# EasyEDA Pro project ProPrj_IR-Sensor-I2C_2025-01-15 (1).epro

# Schematic IR_ring_1
Board Name: IR-Sensoren_1; Create Date: 2025-01-15; Page Name: P2; Project Name: IR-Sensor-I2C; Schematic Name: IR_ring_1; Update Date: 2025-01-15; Company: Gymnasium der Stadt Rahden; Drawn: Louis Bertelsmann; Page Size: A5; Part Number: JLCPCB-001; Version: V0.1
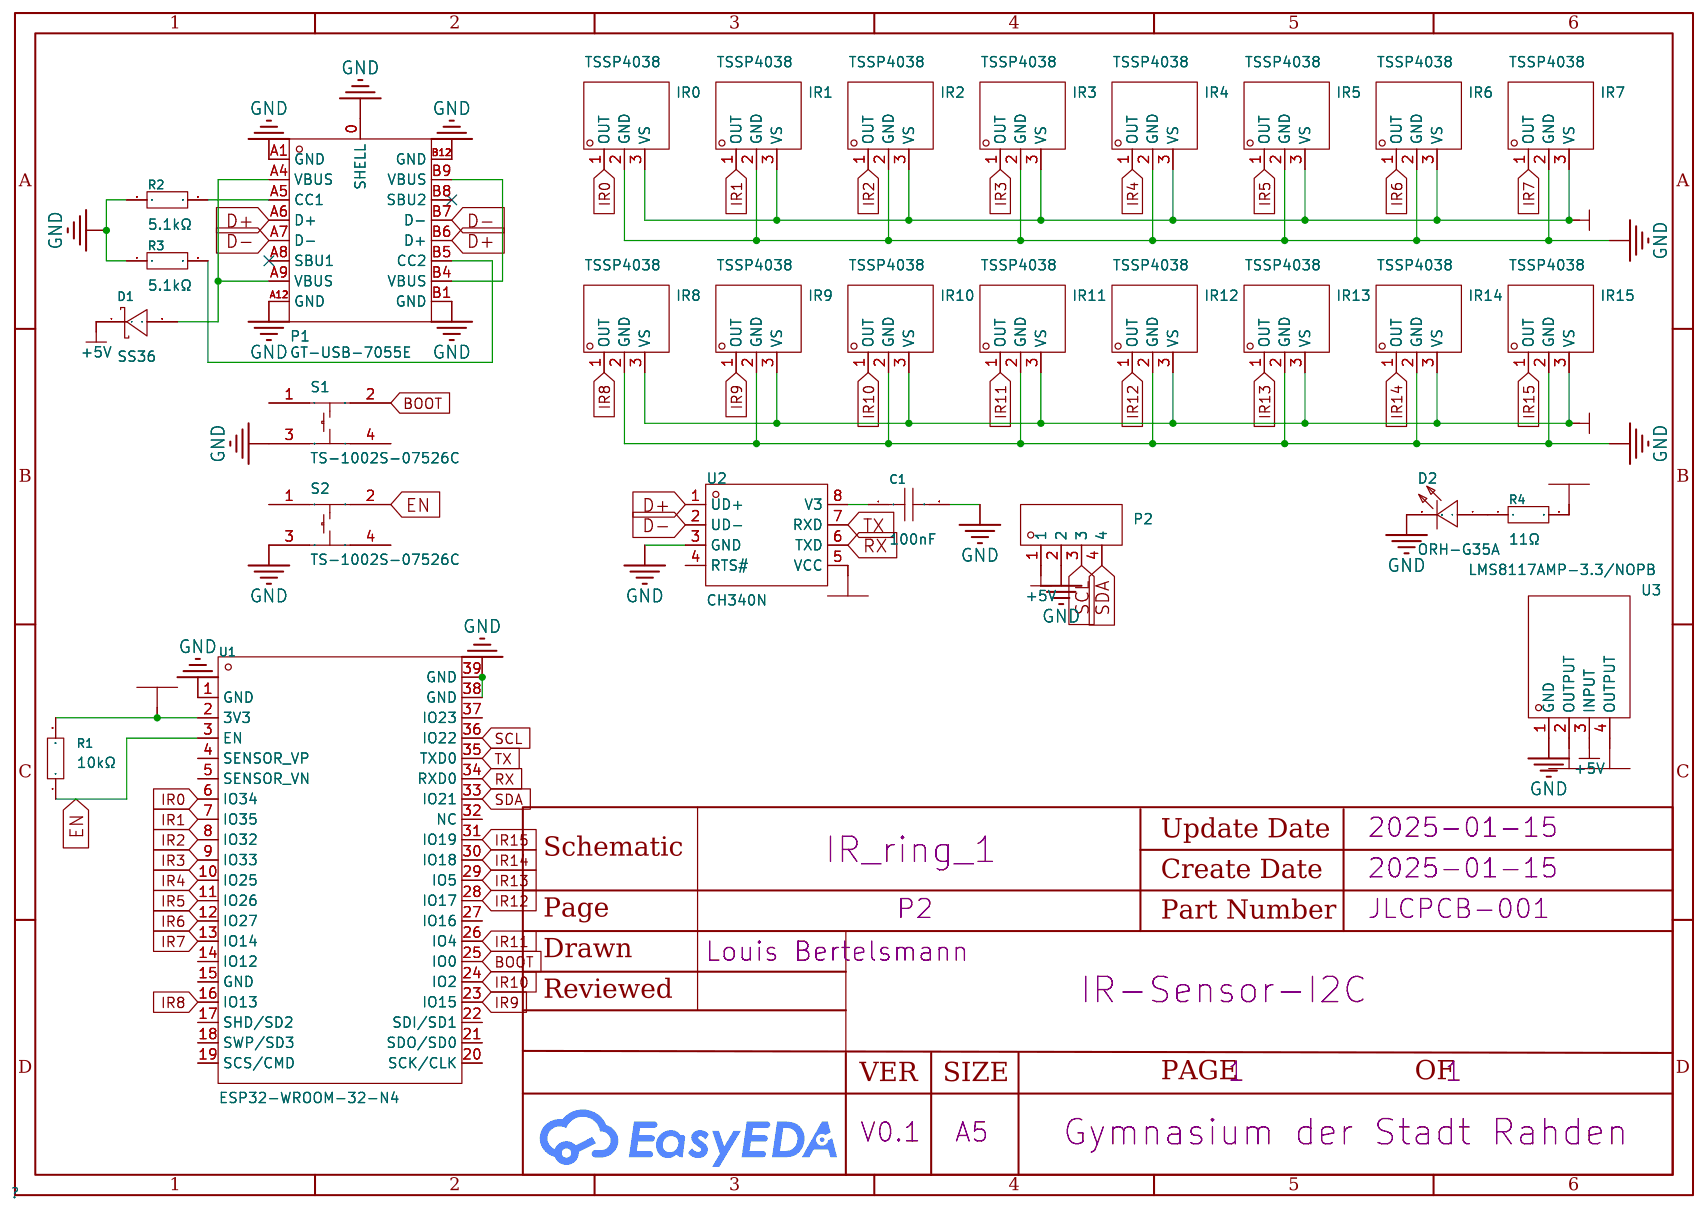
[diagram p0: schematic sheet]

## Parts
C1  100nF  [C0603]
D1  SS36  [SMA_L4.4-W2.8-LS5.4-RD]
D2  ORH-G35A  [LED0805-R-RD]
IR0  TSSP4038  [SENSOR-TH_TSSP40X]
IR1  TSSP4038  [SENSOR-TH_TSSP40X]
IR2  TSSP4038  [SENSOR-TH_TSSP40X]
IR3  TSSP4038  [SENSOR-TH_TSSP40X]
IR4  TSSP4038  [SENSOR-TH_TSSP40X]
IR5  TSSP4038  [SENSOR-TH_TSSP40X]
IR6  TSSP4038  [SENSOR-TH_TSSP40X]
IR7  TSSP4038  [SENSOR-TH_TSSP40X]
IR8  TSSP4038  [SENSOR-TH_TSSP40X]
IR9  TSSP4038  [SENSOR-TH_TSSP40X]
IR10  TSSP4038  [SENSOR-TH_TSSP40X]
IR11  TSSP4038  [SENSOR-TH_TSSP40X]
IR12  TSSP4038  [SENSOR-TH_TSSP40X]
IR13  TSSP4038  [SENSOR-TH_TSSP40X]
IR14  TSSP4038  [SENSOR-TH_TSSP40X]
IR15  TSSP4038  [SENSOR-TH_TSSP40X]
P1  GT-USB-7055E  [USB-C-SMD_GT-USB-7055E]
P2  DZ254S-11-04-48  [HDR-SMD_4P-P2.54-V-M-LS4.8_R2]
R1  10kΩ  [R0603]
R2  5.1kΩ  [R0603]
R3  5.1kΩ  [R0603]
R4  11Ω  [R0603]
S1  TS-1002S-07526C  [SW-SMD_4P-L6.0-W6.0-P4.50-LS9.0-2]
S2  TS-1002S-07526C  [SW-SMD_4P-L6.0-W6.0-P4.50-LS9.0-2]
U1  ESP32-WROOM-32-N4  [WIFIM-SMD_ESP32-WROOM-32-N4]
U2  CH340N  [SOP-8_L4.9-W3.9-P1.27-LS6.0-BL]
U3  LMS8117AMP-3.3/NOPB  [SOT-223_L6.5-W3.5-P2.30-LS7.0-BR]

## Library data of the parts
C1 = CC0603KRX7R9BB104: Capacitance: Tolerance:±10% Tolerance:±10% Voltage Rated: Temperature Coefficient:; LCSC Part Name: 100nF ±10% 50V; Supplier Part: C14663; Manufacturer: YAGEO(国巨); Supplier Footprint: 0603; JLCPCB Part Class: Basic Part; Datasheet: https://atta.szlcsc.com/upload/public/pdf/source/20180910/C282072_33301C7F631E79921B82A8DAC6BCC5B3.pdf; Supplier: LCSC; Tolerance: ±10%; Check: true
D1 = SS36_C116712: Forward Voltage (Vf@If):700mV@3A Reverse Voltage (Vr):60V Average Rectified Current (Io):3A; LCSC Part Name: 电压:60V 电流:3A; Supplier Part: C116712; Manufacturer: 晶导微电子; Supplier Footprint: SMA(DO-214AC); JLCPCB Part Class: Extended Part; Datasheet: https://atta.szlcsc.com/upload/public/pdf/source/20170804/C123938_1501836222047866178.pdf; Supplier: LCSC; Forward Voltage (Vf@If): 700mV@3A; Reverse Voltage (Vr): 60V; Average Rectified Current (Io): 3A; Check: true
D2 = ORH-G35A: Emitted Color:Emerald Forward Voltage (VF):2.7V~3.2V Forward Voltage (VF):2.7V~3.2V Power Dissipation:100mW Forward Current:20mA Dominant Wavelength:522nm~531nm Dominant Wavelength:522nm~531nm Peak Wavelength:525nm Diode Configuration:- Lens Color:无色透明透镜; Supplier Part: C205442; Manufacturer: Orient(奥伦德); Supplier Footprint: 0805; JLCPCB Part Class: Extended Part; Datasheet: https://atta.szlcsc.com/upload/public/pdf/source/20200803/C205442_47D51207775D70672DDC7D9D1E93F2D8.pdf; Supplier: LCSC; Emitted Color: Emerald; Forward Voltage (VF): 2.7V~3.2V; Power Dissipation: 100mW; Forward Current: 20mA; Dominant Wavelength: 522nm~531nm; Peak Wavelength: 525nm; Lens Color: 无色透明透镜; Luminous Intensity: 800mcd~1100mcd; Viewing Angle: 130°; Operating Temperature: -40℃~+85℃; Check: true
IR0-IR15 = TSSP4038: Supply Voltage:2.5V~5.5V Supply Voltage:2.5V~5.5V Supply Current:700uA Transmission Distance:25m Center Frequency:38kHz Half Angle:±45° Power Consumption:10mW Operating Temperature:-25℃~+85℃ Operating Temperature:-25℃~+85℃; LCSC Part Name: 接收距离25m ±45°; Supplier Part: C143753; Manufacturer: VISHAY(威世); Supplier Footprint: SIP-3-2.54mm; JLCPCB Part Class: Extended Part; Datasheet: https://atta.szlcsc.com/upload/public/pdf/source/20171128/C143753_15118626836821147288.pdf; Supplier: LCSC; Supply Voltage: 2.5V~5.5V; Supply Current: 700uA; Transmission Distance: 25m; Center Frequency: 38kHz; Half Angle: ±45°; Power Consumption: 10mW; Operating Temperature: -25℃~+85℃; Check: true
P1 = GT-USB-7055E: Connector Type:Type-C Standard:USB 2.0 Gender:Female Number of Ports:1 Number of Contacts:16P Mounting Style:Brick nogging Current Rating - Power (Max):5A Contact Material:高导铜 Contact Plating:Gold Operating Temperature Range:-40℃~+85℃ Operating Temperatur; LCSC Part Name: Type-C 母 立贴; Supplier Part: C7450622; Manufacturer: G-Switch(品赞); Supplier Footprint: SMD; JLCPCB Part Class: Extended Part; Datasheet: https://atta.szlcsc.com/upload/public/pdf/source/20230712/4C2907DAF9E937754FBC45253E388D05.pdf; Supplier: LCSC; Connector Type: Type-C; Standard: USB 2.0; Gender: Female; Number of Ports: 1; Number of Contacts: 16P; Mounting Style: Brick nogging; Current Rating - Power (Max): 5A; Contact Material: 高导铜; Contact Plating: Gold; Operating Temperature Range: -40℃~+85℃; Check: true
P2 = DZ254S-11-04-48: Pin Structure:1x4P Pitch:2.54mm Circluar Pins/Square Pins:Square Pins Mounting Type:Brick nogging Number of Rows:Plugin Number of Pins:4P; LCSC Part Name: 间距:2.54mm 1x4P 立贴 方针; Supplier Part: C5160787; Manufacturer: DEALON(德艺隆); Supplier Footprint: SMD,P=2.54mm(交错脚); JLCPCB Part Class: Extended Part; Datasheet: https://atta.szlcsc.com/upload/public/pdf/source/20230921/FE4E6D7F32A2CD9B95B1709A1ADE25FC.pdf; Supplier: LCSC; Pin Structure: 1x4P; Pitch: 2.54mm; Circluar Pins/Square Pins: Square Pins; Mounting Type: Brick nogging; Number of Rows: Plugin; Number of Pins: 4P; Check: true
R1 = 0603WAF1002T5E: Type:Thick Film Resistors Resistance:10kΩ Tolerance:±1% Tolerance:±1% Power(Watts): Overload Voltage (Max): Temperature Coefficient:±100ppm/℃ Temperature Coefficient:±100ppm/℃ Operating Temperature Range:-55℃~+155℃ Operating Temperature Range:-55℃~+155℃; LCSC Part Name: 厚膜电阻 10kΩ ±1% 100mW; Supplier Part: C25804; Manufacturer: UNI-ROYAL(厚声); Supplier Footprint: 0603; JLCPCB Part Class: Basic Part; Datasheet: https://atta.szlcsc.com/upload/public/pdf/source/20200306/C422600_1E6D84923E4A46A82E41ADD87F860B5C.pdf; Supplier: LCSC; Type: Thick Film Resistors; Tolerance: ±1%; Temperature Coefficient: ±100ppm/℃; Operating Temperature Range: -55℃~+155℃; Check: true
R2 R3 = 0603WAF5101T5E: Type:Thick Film Resistors Resistance:5.1kΩ Tolerance:±1% Tolerance:±1% Power(Watts): Overload Voltage (Max): Temperature Coefficient:±100ppm/℃ Temperature Coefficient:±100ppm/℃ Operating Temperature Range:-55℃~+155℃ Operating Temperature Range:-55℃~+155℃; LCSC Part Name: 5.1kΩ ±1% 100mW 厚膜电阻; Supplier Part: C23186; Manufacturer: UNI-ROYAL(厚声); Supplier Footprint: 0603; JLCPCB Part Class: Basic Part; Datasheet: https://atta.szlcsc.com/upload/public/pdf/source/20200306/C422600_1E6D84923E4A46A82E41ADD87F860B5C.pdf; Supplier: LCSC; Type: Thick Film Resistors; Tolerance: ±1%; Temperature Coefficient: ±100ppm/℃; Operating Temperature Range: -55℃~+155℃; Check: true
R4 = 0603WAF110JT5E: Type:Thick Film Resistors Resistance:11Ω Tolerance:±1% Tolerance:±1% Power(Watts): Overload Voltage (Max): Temperature Coefficient:±200ppm/℃ Temperature Coefficient:±200ppm/℃ Operating Temperature Range:-55℃~+155℃ Operating Temperature Range:-55℃~+155℃; LCSC Part Name: 11Ω ±1% 100mW 厚膜电阻; Supplier Part: C25184; Manufacturer: UNI-ROYAL(厚声); Supplier Footprint: 0603; JLCPCB Part Class: Extended Part; Datasheet: https://atta.szlcsc.com/upload/public/pdf/source/20200306/C422600_1E6D84923E4A46A82E41ADD87F860B5C.pdf; Supplier: LCSC; Type: Thick Film Resistors; Tolerance: ±1%; Temperature Coefficient: ±200ppm/℃; Operating Temperature Range: -55℃~+155℃; Check: true
S1 S2 = TS-1002S-07526C: Contact Current:50mA Voltage Rating (DC):12V Circuit:SPST Mounting Style:Brick nogging Actuator Style:Round Button With Lamp:- Switch Length:6mm Switch Width:6mm Switch Height:7.5mm; LCSC Part Name: 贴片轻触开关 260GF; Supplier Part: C455115; Manufacturer: XUNPU(讯普); Supplier Footprint: SMD,6x6x7.5mm; JLCPCB Part Class: Extended Part; Datasheet: https://atta.szlcsc.com/upload/public/pdf/source/20191118/C455115_D4B6DCDA06BDE14AA353AA414B73FF9E.pdf; Supplier: LCSC; Contact Current: 50mA; Voltage Rating (DC): 12V; Circuit: SPST; Mounting Style: Brick nogging; Actuator Style: Round Button; Switch Length: 6mm; Switch Width: 6mm; Switch Height: 7.5mm; Check: true
U1 = ESP32-WROOM-32-N4: LCSC Part Name: WiFi+蓝牙4.2+双核CPU模块; Supplier Part: C82899; Manufacturer: ESPRESSIF(乐鑫); Supplier Footprint: SMD,18x25.5mm; JLCPCB Part Class: Extended Part; Datasheet: https://atta.szlcsc.com/upload/public/pdf/source/20210719/C82899_2D52724B6FAFABC419BCF308C5944296.pdf; Supplier: LCSC; Check: true
U2 = CH340N: LCSC Part Name: USB转串口芯片 CH340; Supplier Part: C2977777; Manufacturer: WCH(南京沁恒); Supplier Footprint: SOP-8; JLCPCB Part Class: Extended Part; Datasheet: https://atta.szlcsc.com/upload/public/pdf/source/20230530/6E401E9554E9F5311886CC8B3F89B62E.pdf; Supplier: LCSC; Check: true
U3 = LMS8117AMP-3.3/NOPB: Output Type:Fixed Maximum Input Voltage:15V Output Voltage:3.3V Output Voltage:3.3V Output Current:1A Power Supply Rejection Ratio (PSRR):75dB@(120Hz) Dropout Voltage:1.25V@(1A) standby current:5mA Feature:防静电保护；Thermal Protection(TSD)；Overcurrent Protect; LCSC Part Name: 具有 0°C 至 125°C 工作温度范围的 1A、15V 高精度线性稳压器; Supplier Part: C201952; Manufacturer: TI(德州仪器); Supplier Footprint: SOT-223; JLCPCB Part Class: Extended Part; Datasheet: https://www.ti.com/cn/lit/gpn/lms8117a; Supplier: LCSC; Output Type: Fixed; Maximum Input Voltage: 15V; Output Voltage: 3.3V; Output Current: 1A; Power Supply Rejection Ratio (PSRR): 75dB@(120Hz); Dropout Voltage: 1.25V@(1A); standby current: 5mA; Feature: 防静电保护；Thermal Protection(TSD)；Overcurrent Protection(OCP)；带使能; Operating Temperature: 0℃~+125℃; Output Polarity: Positive electrode; Number of Outputs: 1; Check: true

## Nets
3V3: IR0.3(VS) IR1.3(VS) IR2.3(VS) IR3.3(VS) IR4.3(VS) IR5.3(VS) IR6.3(VS) IR7.3(VS) IR8.3(VS) IR9.3(VS) IR10.3(VS) IR11.3(VS) IR12.3(VS) IR13.3(VS) IR14.3(VS) IR15.3(VS) R1.2 R4.2 U1.2(3V3) U2.5(VCC) U3.2(OUTPUT) U3.4(OUTPUT)
+5V: D1.1(K) P2.1 U3.3(INPUT)
GND: C1.2 D2.2(C) IR0.2(GND) IR1.2(GND) IR2.2(GND) IR3.2(GND) IR4.2(GND) IR5.2(GND) IR6.2(GND) IR7.2(GND) IR8.2(GND) IR9.2(GND) IR10.2(GND) IR11.2(GND) IR12.2(GND) IR13.2(GND) IR14.2(GND) IR15.2(GND) P1.0(SHELL) P1.A1(GND) P1.A12(GND) P1.B1(GND) P1.B12(GND) P2.2 R2.1 R3.1 S1.3 S2.3 U1.1(GND) U1.38(GND) U1.39(GND) U2.3(GND) U3.1(GND)
BOOT: S1.2 U1.25(IO0)
D+: P1.A6(D+) P1.B6(D+) U2.1(UD+)
D-: P1.A7(D-) P1.B7(D-) U2.2(UD-)
EN: R1.1 S2.2 U1.3(EN)
IR0: IR0.1(OUT) U1.6(IO34)
IR1: IR1.1(OUT) U1.7(IO35)
IR2: IR2.1(OUT) U1.8(IO32)
IR3: IR3.1(OUT) U1.9(IO33)
IR4: IR4.1(OUT) U1.10(IO25)
IR5: IR5.1(OUT) U1.11(IO26)
IR6: IR6.1(OUT) U1.12(IO27)
IR7: IR7.1(OUT) U1.13(IO14)
IR8: IR8.1(OUT) U1.16(IO13)
IR9: IR9.1(OUT) U1.23(IO15)
IR10: IR10.1(OUT) U1.24(IO2)
IR11: IR11.1(OUT) U1.26(IO4)
IR12: IR12.1(OUT) U1.28(IO17)
IR13: IR13.1(OUT) U1.29(IO5)
IR14: IR14.1(OUT) U1.30(IO18)
IR15: IR15.1(OUT) U1.31(IO19)
RX: U1.34(RXD0) U2.6(TXD)
SCL: P2.3 U1.36(IO22)
SDA: P2.4 U1.33(IO21)
TX: U1.35(TXD0) U2.7(RXD)
$2N12726: C1.1 U2.8(V3)
$2N18778: P1.B4(VBUS) P1.B9(VBUS)
$2N18900: P1.A5(CC1) R2.2
$2N18903: P1.B5(CC2) R3.2
$2N18915: D1.2(A) P1.A4(VBUS) P1.A9(VBUS)
$2N23008: D2.1(A) R4.1

Not connected (* = marked no-connect by the designer): P1 A8(SBU1)* B8(SBU2)*; S1 1 4; S2 1 4; U1 4(SENSOR_VP) 5(SENSOR_VN) 14(IO12) 15(GND) 17(SHD/SD2) 18(SWP/SD3) 19(SCS/CMD) 20(SCK/CLK) 21(SDO/SD0) 22(SDI/SD1) 27(IO16) 32(NC) 37(IO23); U2 4(RTS#)

# Board IR-Ring_1
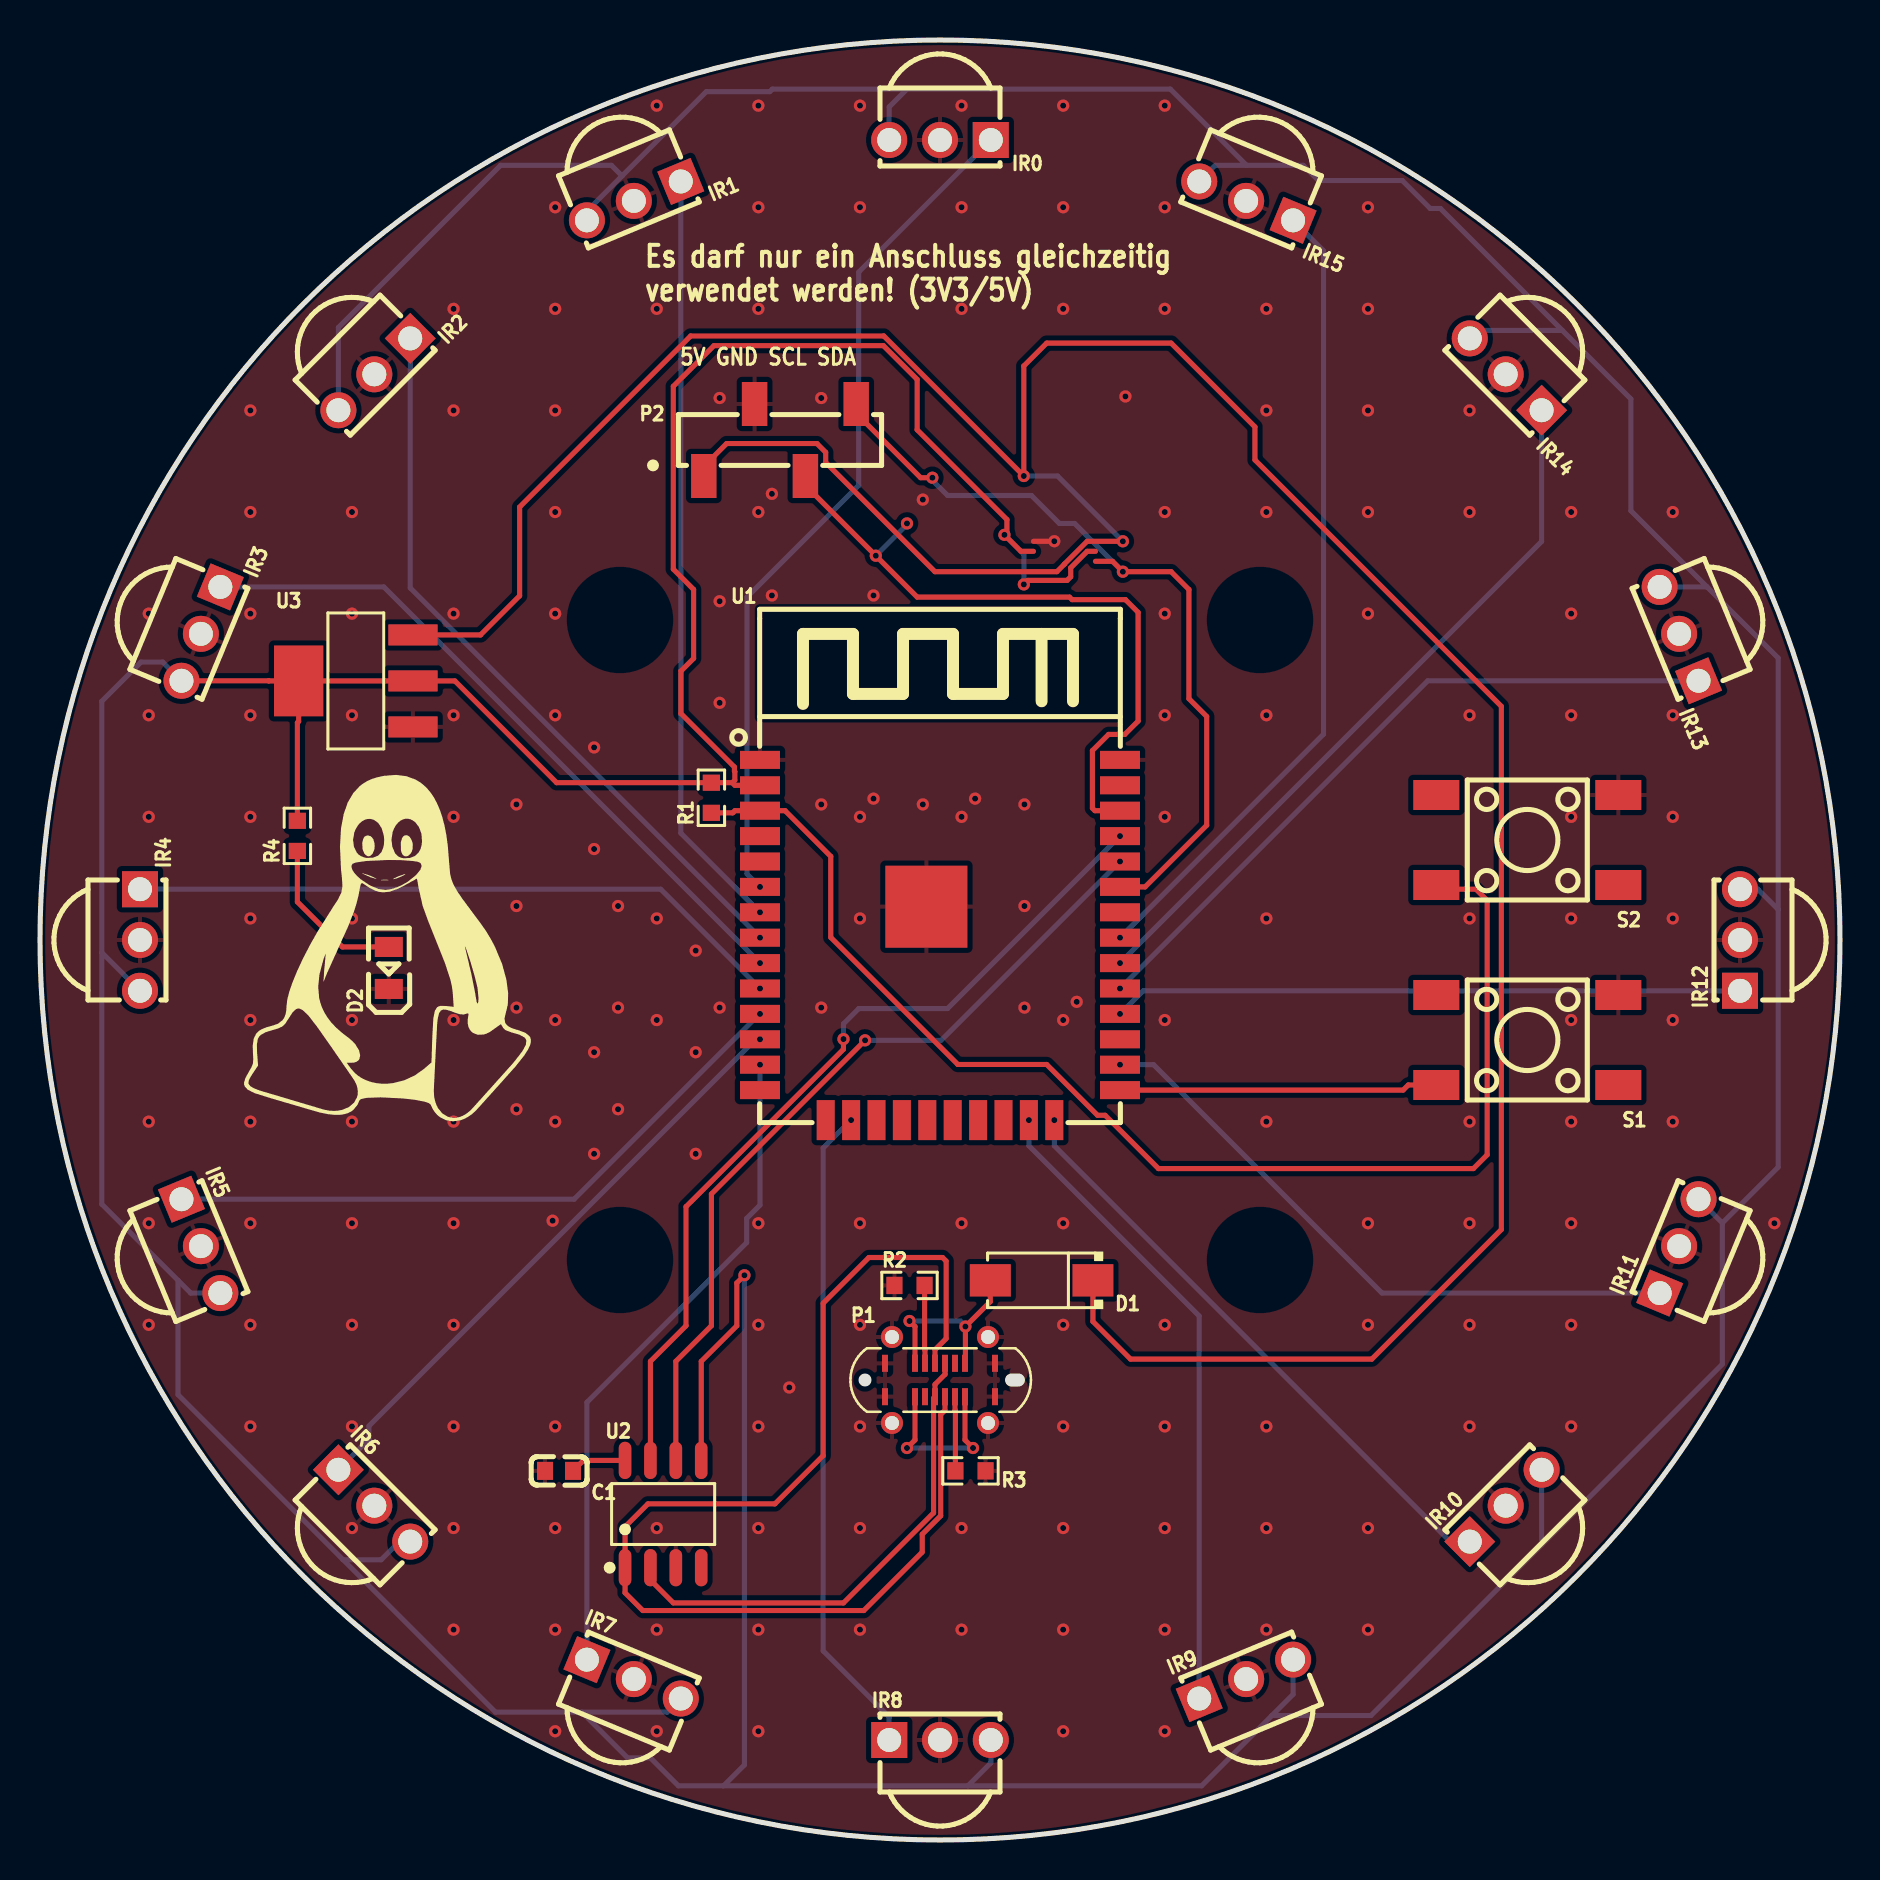
[diagram p1: board, top side]
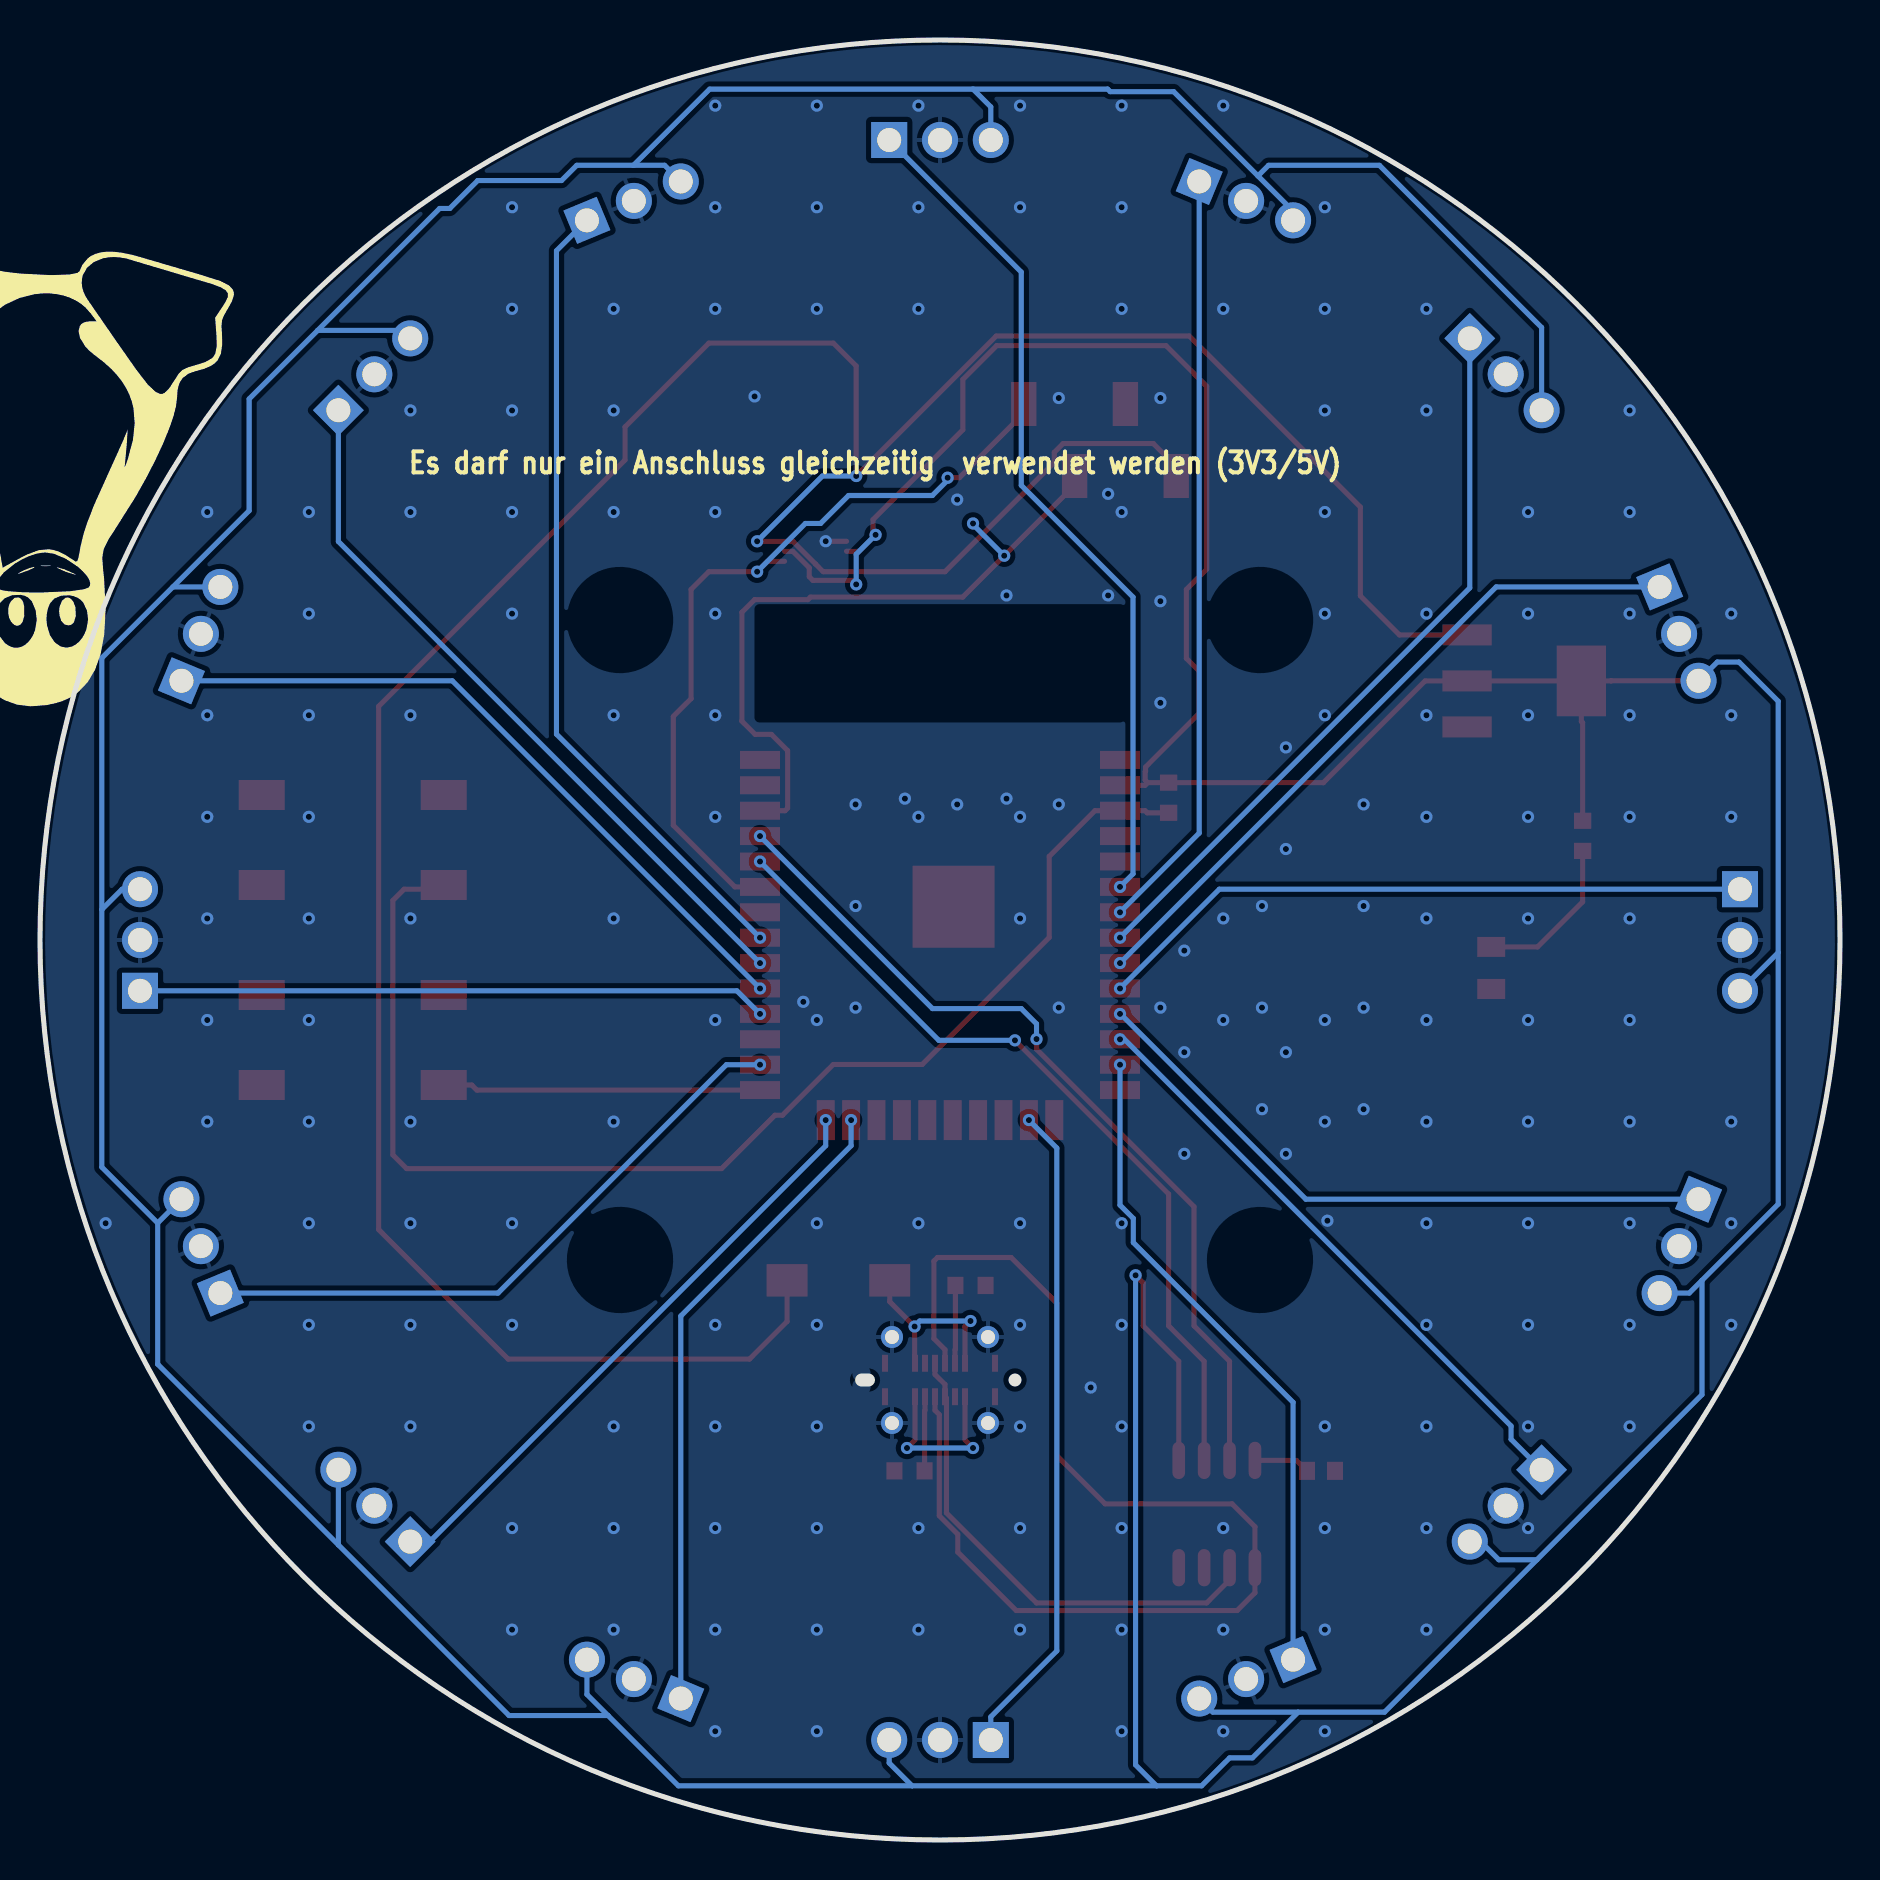
[diagram p2: board, bottom side, seen from below]

Outline 90 x 90 mm; copper layers: Top Layer, Bottom Layer. Coordinates in mm from the lower left corner of the outline.
Outline path: circle c45,45 r45
Stack: Top Layer 0.035mm / Dielectric1 1.51mm FR4 er 4.5 / Bottom Layer 0.035mm

## Design rules (mm)
template: JLCPCB Capability(Two Layers Board)
spacing copperThickness1oz (default): track to track 0.102, other pairs 0.152 to 0.3
spacing copperThickness2oz: track to track 0.203, other pairs 0.152 to 0.3
track width copperThickness1oz (default): min 0.127, default 0.254, max 2.54
track width copperThickness2oz: min 0.203, default 0.254, max 2.54
differential pair differentialPair (default): width min 0.127, default 0.254, max 2.54; gap min 0.152, default 0.152
via viaSize (default): diameter min 0.5, default 0.61, max 10; hole min 0.3, default 0.305, max 6.3

## Placement (name value [footprint] x y rotation side)
C1  100nF  [C0603]  25.95 18.46 180 top
D1  SS36  [SMA_L4.4-W2.8-LS5.4-RD]  50.08 27.98 180 top
D2  ORH-G35A  [LED0805-R-RD]  17.44 43.6 90 top
IR0  TSSP4038  [SENSOR-TH_TSSP40X]  45 85 180 top
IR1  TSSP4038  [SENSOR-TH_TSSP40X]  29.69 81.95 202.5 top
IR2  TSSP4038  [SENSOR-TH_TSSP40X]  16.72 73.28 225 top
IR3  TSSP4038  [SENSOR-TH_TSSP40X]  8.05 60.31 247.5 top
IR4  TSSP4038  [SENSOR-TH_TSSP40X]  5 45 270 top
IR5  TSSP4038  [SENSOR-TH_TSSP40X]  8.05 29.69 292.5 top
IR6  TSSP4038  [SENSOR-TH_TSSP40X]  16.72 16.72 315 top
IR7  TSSP4038  [SENSOR-TH_TSSP40X]  29.69 8.04 337.5 top
IR8  TSSP4038  [SENSOR-TH_TSSP40X]  45 5 0 top
IR9  TSSP4038  [SENSOR-TH_TSSP40X]  60.31 8.04 22.5 top
IR10  TSSP4038  [SENSOR-TH_TSSP40X]  73.28 16.72 45 top
IR11  TSSP4038  [SENSOR-TH_TSSP40X]  81.96 29.69 67.5 top
IR12  TSSP4038  [SENSOR-TH_TSSP40X]  85 45 90 top
IR13  TSSP4038  [SENSOR-TH_TSSP40X]  81.96 60.31 112.5 top
IR14  TSSP4038  [SENSOR-TH_TSSP40X]  73.28 73.28 135 top
IR15  TSSP4038  [SENSOR-TH_TSSP40X]  60.31 81.95 157.5 top
P1  GT-USB-7055E  [USB-C-SMD_GT-USB-7055E]  45 23 0 top
P2  DZ254S-11-04-48  [HDR-SMD_4P-P2.54-V-M-LS4.8_R2]  37 70 0 top
R1  10kΩ  [R0603]  33.57 52.11 90 top
R2  5.1kΩ  [R0603]  43.48 27.73 0 top
R3  5.1kΩ  [R0603]  46.52 18.46 180 top
R4  11Ω  [R0603]  12.87 50.21 90 top
S1  TS-1002S-07526C  [SW-SMD_4P-L6.0-W6.0-P4.50-LS9.0-2]  74.37 40 180 top
S2  TS-1002S-07526C  [SW-SMD_4P-L6.0-W6.0-P4.50-LS9.0-2]  74.37 50 180 top
U1  ESP32-WROOM-32-N4  [WIFIM-SMD_ESP32-WROOM-32-N4]  45 45 0 top
U2  CH340N  [SOP-8_L4.9-W3.9-P1.27-LS6.0-BL]  31.16 16.3 0 top
U3  LMS8117AMP-3.3/NOPB  [SOT-223_L6.5-W3.5-P2.30-LS7.0-BR]  15.79 57.95 0 top

## Footprints (pads in the part's own frame, mm; a bottom-side part is the same pattern mirrored in y, then rotated)
C0603
  rect 0.8x0.9 smd: 1(-0.7,0) 2(0.7,0)
HDR-SMD_4P-P2.54-V-M-LS4.8_R2
  rect 1.27x2.2 smd: 1(-3.81,-1.8) 2(-1.27,1.8) 3(1.27,-1.8) 4(3.81,1.8)
LED0805-R-RD
  rect 1x1.399 smd: 1(1.05,0) 2(-1.05,0)
R0603
  rect 0.806x0.864 smd: 1(-0.753,0) 2(0.753,0)
SENSOR-TH_TSSP40X
  rect 1.8x1.8 hole 1.2: 1(-2.54,0)
  round 1.8 hole 1.2: 2(0,0) 3(2.54,0)
SMA_L4.4-W2.8-LS5.4-RD
  rect 2.046x1.62 smd: 1(-2.566,0) 2(2.566,0)
SOP-8_L4.9-W3.9-P1.27-LS6.0-BL
  oval 0.63x1.865 smd: 1(-1.905,-2.683) 2(-0.635,-2.683) 3(0.635,-2.683) 4(1.905,-2.683) 5(1.905,2.683) 6(0.635,2.683) 7(-0.635,2.683) 8(-1.905,2.683)
SOT-223_L6.5-W3.5-P2.30-LS7.0-BR
  rect 2.465x1.05 smd: 1(2.857,-2.3) 2(2.857,0) 3(2.857,2.3)
  rect 2.465x3.54 smd: 4(-2.857,0)
SW-SMD_4P-L6.0-W6.0-P4.50-LS9.0-2
  rect 2.3x1.5 smd: 1(-4.55,2.25) 2(4.55,2.25) 3(-4.55,-2.25) 4(4.55,-2.25)
USB-C-SMD_GT-USB-7055E
  round 1.1 hole 0.7: 0(-2.4,2.15) 0(-2.4,-2.15) 0(2.4,2.15) 0(2.4,-2.15)
  rect 0.3x0.85 smd: A1(-2.75,0.835) A4(-1.25,0.835) A5(-0.75,0.835) A6(-0.25,0.835) A7(0.25,0.835) A8(0.75,0.835) A9(1.25,0.835) A12(2.75,0.835) B1(2.75,-0.835) B4(1.25,-0.835) B5(0.75,-0.835) B6(0.25,-0.835) B7(-0.25,-0.835) B8(-0.75,-0.835) B9(-1.25,-0.835) B12(-2.75,-0.835)
WIFIM-SMD_ESP32-WROOM-32-N4
  rect 2x0.9 smd: 1(-9,9.005) 2(-9,7.735) 3(-9,6.465) 4(-9,5.195) 5(-9,3.925) 6(-9,2.655) 7(-9,1.385) 8(-9,0.115) 9(-9,-1.155) 10(-9,-2.425) 11(-9,-3.695) 12(-9,-4.965) 13(-9,-6.235) 14(-9,-7.505) 25(9,-7.505) 26(9,-6.235) 27(9,-4.965) 28(9,-3.695) 29(9,-2.425) 30(9,-1.155) 31(9,0.115) 32(9,1.385) 33(9,2.655) 34(9,3.925) 35(9,5.195) 36(9,6.465) 37(9,7.735) 38(9,9.005)
  rect 0.9x2 smd: 15(-5.715,-9.005) 16(-4.445,-9.005) 17(-3.175,-9.005) 18(-1.905,-9.005) 19(-0.635,-9.005) 20(0.635,-9.005) 21(1.905,-9.005) 22(3.175,-9.005) 23(4.445,-9.005) 24(5.715,-9.005)
  rect 4.1x4.1 smd: 39(-0.68,1.665)

## Nets
As in the schematic.

Pads without a net: P1 A8 B8; S1 1 4; S2 1 4; U1 4 5 14 15 17 18 19 20 21 22 27 32 37; U2 4

## Via types
v1: diameter 0.61, hole 0.305, Top Layer to Bottom Layer, 221 vias

## Routing (per net, layer and track width the routed paths; a pad name or vN(x,y) marks a point on that pad's centre or on a via; arc(x,y) is an arc through that point)
3V3: length 440.6
  Top Layer w0.254: U3.4 12.93,55.93 12.87,55.87 R4.2 ; U3.4 11.45,57.95 11.44,57.96 IR3.3 ; U3.4 U3.2 20.74,57.95 25.83,52.87 R1.2 34.62,52.87 ; 34.62,52.87 34.74,52.99 34.74,53.42 34.72,53.44 34.72,53.65 32.05,56.32 32.05,58.44 32.68,59.08 32.68,62.53 31.66,63.54 31.66,72.69 33.7,74.72 42.17,74.72 43.86,73.03 43.86,70.51 48.35,66.02 48.35,65.39 v1(48.22,65.26) 49.04,64.44 49.67,64.44 ; 34.62,52.87 34.75,52.73 U1.2 ; U2.5 33.06,23.93 34.84,25.71 34.84,27.86 v1(35.22,28.24) ; 52.77,64.44 52.36,64.44 51.54,63.61 51.54,63.16 51.36,62.98 49.39,62.98 v1(49.19,62.78)
  Bottom Layer w0.254: 84.12,30.85 IR11.3 ; 84.12,30.85 84.12,23.79 75.08,14.76 ; 84.12,30.85 86.91,33.64 86.91,46.52 ; 76.12,75.48 79.54,72.05 79.54,66.46 83.35,62.65 ; 76.12,75.48 71.89,75.48 IR14.3 ; 76.12,75.48 70.02,81.58 69.51,81.58 68.11,82.97 63.92,82.97 63.16,83.73 60.33,83.73 ; 27.09,6.39 31.36,6.39 IR7.3 ; 27.09,6.39 22.78,6.39 15.16,14.01 ; 27.09,6.39 29.38,4.11 30.52,4.11 31.92,2.71 34.17,2.71 ; 46.4,2.71 47.54,3.85 IR8.3 ; 46.4,2.71 34.17,2.71 ; 46.4,2.71 58.08,2.71 61.59,6.22 ; 75.08,14.76 IR10.3 ; 75.08,14.76 66.55,6.22 61.59,6.22 ; 43.35,87.55 42.46,86.66 IR0.3 ; 43.35,87.55 36.62,87.55 36.49,87.42 33.32,87.42 29.1,83.2 ; 43.35,87.55 56.52,87.55 60.33,83.73 ; 3.09,44.37 3.09,31.79 6.9,27.98 ; 3.09,44.37 3.09,56.94 5.05,58.9 6.14,58.9 IR3.3 ; 3.09,44.37 IR4.3 ; 61.59,6.22 62.65,7.28 62.65,9.02 ; IR12.3 85.89,47.54 86.91,46.52 ; 60.33,83.73 58.77,83.73 IR15.3 ; 6.9,27.98 6.9,22.27 15.16,14.01 ; 6.9,27.98 7.54,27.35 9.02,27.35 ; 86.91,46.52 86.91,59.1 83.35,62.65 ; 27.35,80.98 27.35,81.45 29.1,83.2 ; 15.16,14.01 17.06,14.01 17.97,14.92 IR6.3 ; 83.35,62.65 80.98,62.65 ; v1(49.19,62.78) 49.19,64.29 v1(48.22,65.26) ; v1(35.22,28.24) 35.22,3.76 34.17,2.71 ; IR2.3 14.92,75.63 23.03,83.73 28.57,83.73 29.1,83.2
+5V: length 164.5
  Top Layer w0.254: U3.3 22.03,60.25 23.98,62.21 23.98,66.65 32.53,75.2 42.19,75.2 v1(49.19,68.2) 49.19,73.7 50.33,74.84 56.56,74.84 60.75,70.65 60.75,69 73.07,56.68 73.07,30.52 66.59,24.04 54.53,24.04 52.65,25.92 D1.1 ; P2.1 33.19,68.68 34.33,69.82 38.85,69.82 39.28,69.38 39.28,68.88 44.75,63.42 50.84,63.42 51.22,63.8 51.22,63.8 52.36,64.94 v1(54.14,64.94)
  Bottom Layer w0.254: v1(49.19,68.2) 50.88,68.2 v1(54.14,64.94)
GND: length 1
  Top Layer w0.254: v1(50.72,64.94) 50.71,64.94 49.67,64.94
  vias: v1(5.44,61.32) v1(5.44,56.24) v1(5.44,51.16) v1(5.44,35.92) v1(5.44,30.84) v1(5.44,25.76) v1(10.52,71.48) v1(10.52,66.4) v1(10.52,61.32) v1(10.52,56.24) v1(10.52,51.16) v1(10.52,46.08) v1(10.52,41) v1(10.52,35.92) v1(10.52,30.84) v1(10.52,25.76) v1(10.52,20.68) v1(15.6,66.4) v1(15.6,61.32) v1(15.6,56.24) v1(15.6,51.16) v1(15.6,46.08) v1(15.6,41) v1(15.6,35.92) v1(15.6,30.84) v1(15.6,25.76) v1(15.6,20.68) v1(15.6,15.6) v1(20.68,76.56) v1(20.68,71.48) v1(20.68,61.32) v1(20.68,56.24) v1(20.68,51.16) v1(20.68,46.08) v1(20.68,41) v1(20.68,35.92) v1(20.68,30.84) v1(20.68,25.76) v1(20.68,20.68) v1(20.68,15.6) v1(20.68,10.52) v1(23.82,51.78) v1(23.82,46.7) v1(23.82,41.62) v1(23.82,36.54) v1(25.63,30.97) v1(25.76,81.64) v1(25.76,76.56) v1(25.76,71.48) v1(25.76,66.4) v1(25.76,61.32) v1(25.76,56.24) v1(25.76,41) v1(25.76,35.92) v1(25.76,20.68) v1(25.76,15.6) v1(25.76,10.52) v1(25.76,5.44) v1(27.71,54.63) v1(27.71,49.55) v1(27.71,39.39) v1(27.71,34.31) v1(28.9,46.7) v1(28.9,41.62) v1(28.9,36.54) v1(30.84,86.72) v1(30.84,76.56) v1(30.84,46.08) v1(30.84,41) v1(30.84,15.6) v1(30.84,10.52) v1(30.84,5.44) v1(32.78,44.47) v1(32.78,39.39) v1(32.78,34.31) v1(33.98,72.1) v1(33.98,61.94) v1(33.98,56.86) v1(33.98,41.62) v1(35.92,86.72) v1(35.92,81.64) v1(35.92,76.56) v1(35.92,66.4) v1(35.92,30.84) v1(35.92,25.76) v1(35.92,20.68) v1(35.92,15.6) v1(35.92,10.52) v1(35.92,5.44) v1(36.59,67.31) v1(36.59,62.23) v1(37.46,22.62) v1(39.06,72.1) v1(39.06,51.78) v1(39.06,41.62) v1(41,86.72) v1(41,81.64) v1(41,51.16) v1(41,46.08) v1(41,30.84) v1(41,25.76) v1(41,20.68) v1(41,15.6) v1(41,10.52) v1(41.68,62.23) v1(41.68,52.07) v1(44.14,67.02) v1(44.14,51.78) v1(46.08,86.72) v1(46.08,81.64) v1(46.08,76.56) v1(46.08,51.16) v1(46.08,30.84) v1(46.08,15.6) v1(46.08,10.52) v1(46.75,52.07) v1(49.22,51.78) v1(49.22,46.7) v1(49.22,41.62) v1(51.16,86.72) v1(51.16,81.64) v1(51.16,76.56) v1(51.16,41) v1(51.16,30.84) v1(51.16,25.76) v1(51.16,20.68) v1(51.16,15.6) v1(51.16,10.52) v1(51.16,5.44) v1(51.84,41.91) v1(54.27,72.18) v1(56.24,86.72) v1(56.24,81.64) v1(56.24,76.56) v1(56.24,66.4) v1(56.24,61.32) v1(56.24,56.24) v1(56.24,51.16) v1(56.24,41) v1(56.24,25.76) v1(56.24,20.68) v1(56.24,15.6) v1(56.24,10.52) v1(56.24,5.44) v1(61.32,76.56) v1(61.32,71.48) v1(61.32,66.4) v1(61.32,56.24) v1(61.32,46.08) v1(61.32,35.92) v1(61.32,20.68) v1(61.32,15.6) v1(61.32,10.52) v1(66.4,81.64) v1(66.4,76.56) v1(66.4,71.48) v1(66.4,66.4) v1(66.4,61.32) v1(66.4,30.84) v1(66.4,25.76) v1(66.4,15.6) v1(66.4,10.52) v1(71.48,71.48) v1(71.48,66.4) v1(71.48,56.24) v1(71.48,46.08) v1(71.48,35.92) v1(71.48,30.84) v1(71.48,25.76) v1(71.48,20.68) v1(76.56,66.4) v1(76.56,61.32) v1(76.56,56.24) v1(76.56,51.16) v1(76.56,46.08) v1(76.56,41) v1(76.56,35.92) v1(76.56,30.84) v1(76.56,25.76) v1(76.56,20.68) v1(81.64,66.4) v1(81.64,56.24) v1(81.64,51.16) v1(81.64,46.08) v1(81.64,41) v1(81.64,35.92) v1(86.72,30.84)
BOOT: length 15.9
  Top Layer w0.254: U1.25 68.16,37.5 68.41,37.75 S1.2
D+: length 59.5
  Top Layer w0.254: P1.B6 45.25,21.49 45.03,21.27 45.03,16.21 44.11,15.29 44.11,14.39 41.19,11.47 30.14,11.47 29.25,12.36 U2.1 29.25,15.66 30.4,16.81 36.75,16.81 39.16,19.22 39.16,26.84 41.44,29.12 45.13,29.12 45.31,28.95 45.31,25.07 44.75,24.51 P1.A6
D-: length 24.8
  Top Layer w0.254: P1.A7 45.25,23.83 45.25,23.28 44.75,22.78 P1.B7 44.68,22.09 44.68,16.36 40.17,11.85 31.67,11.85 30.52,13 U2.2
EN: length 64.5
  Top Layer w0.254: R1.1 34.64,51.36 34.75,51.47 U1.3 37.25,51.47 39.54,49.18 39.54,45.13 45.89,38.78 50.33,38.78 52.87,36.24 53.25,36.24 55.92,33.57 71.67,33.57 72.36,34.26 72.36,46.98 71.8,47.54 70.03,47.54 S2.2
IR0: length 42.7
  Bottom Layer w0.254: IR0.1 40.94,78.4 40.94,67.73 35.35,62.14 35.35,48.31 v1(36,47.66)
IR1: length 38.2
  Bottom Layer w0.254: IR1.1 32.04,50.35 v1(36,46.39)
IR2: length 37.2
  Bottom Layer w0.254: IR2.1 18.51,62.6 v1(36,45.11)
IR3: length 34.8
  Bottom Layer w0.254: 9.02,62.65 17.19,62.65 v1(36,43.84)
IR4: length 33.1
  Bottom Layer w0.254: IR4.1 31.03,47.54 v1(36,42.58)
IR5: length 32.8
  Bottom Layer w0.254: v1(36,41.31) 35.97,41.31 26.71,32.04 IR5.1
IR6: length 30.4
  Bottom Layer w0.254: IR6.1 16.45,20.04 16.45,20.7 35.78,40.03 v1(36,40.03)
IR7: length 33.3
  Bottom Layer w0.254: 27.35,9.02 27.35,21.88 35.33,29.87 35.33,31.08 36,31.75 v1(36,38.77)
IR8: length 32.9
  Bottom Layer w0.254: IR8.1 42.46,6.15 39.16,9.46 39.16,34.6 v1(40.56,36)
IR9: length 32.4
  Bottom Layer w0.254: IR9.1 57.96,26.2 49.44,34.71 v1(49.44,36)
IR10: length 30.3
  Bottom Layer w0.254: v1(50.72,36) 50.72,34.71 70.51,14.92 IR10.1
IR11: length 31.7
  Bottom Layer w0.254: 80.98,27.35 67.1,27.35 55.68,38.77 v1(54,38.77)
IR12: length 31.5
  Bottom Layer w0.254: IR12.1 55.16,42.46 v1(54,41.31)
IR13: length 35.3
  Bottom Layer w0.254: IR13.1 69.39,57.96 v1(54,42.58)
IR14: length 36.4
  Bottom Layer w0.254: IR14.1 75.08,64.93 v1(54,43.84)
IR15: length 40.7
  Bottom Layer w0.254: v1(54,45.11) 64.18,55.29 64.18,79.46 62.65,80.98
RX: length 41.4
  Top Layer w0.254: v1(41.25,39.98) 33.57,32.3 33.57,25.71 31.79,23.93 U2.6
  Bottom Layer w0.254: v1(54,48.92) 45.06,39.98 v1(41.25,39.98)
SCL: length 34.6
  Top Layer w0.254: U1.36 52.75,51.47 52.62,51.59 52.62,54.47 53.43,55.28 54.24,55.28 54.91,55.95 54.91,61.38 54.27,62.02 51.6,62.02 51.48,62.14 43.86,62.14 v1(41.79,64.21) 38.27,67.73 P2.3
  Bottom Layer w0.254: v1(43.35,65.83) 43.35,65.77 v1(41.79,64.21)
SDA: length 40.2
  Top Layer w0.254: P2.4 40.81,71.33 44.03,68.11 v1(44.62,68.11) ; U1.33 55.25,47.66 58.34,50.74 58.34,56.18 57.45,57.06 57.45,62.53 56.56,63.42 v1(54.14,63.42) 53.62,63.94 52.77,63.94
  Bottom Layer w0.254: v1(44.62,68.11) 44.62,67.99 45.38,67.22 49.57,67.22 50.97,65.83 51.73,65.83 v1(54.14,63.42)
TX: length 43.5
  Top Layer w0.254: U2.7 30.52,23.93 32.3,25.71 32.3,31.67 40.17,39.54 v1(40.17,40.05)
  Bottom Layer w0.254: v1(40.17,40.05) 40.17,40.81 40.94,41.57 45.38,41.57 v1(54,50.19)
$2N12726: length 2.8
  Top Layer w0.254: U2.8 27.17,18.98 C1.1
$2N18778: length 8.8
  Top Layer w0.254: v1(43.35,19.6) 43.75,20 P1.B9 ; P1.B4 46.25,20 v1(46.65,19.6)
  Bottom Layer w0.254: v1(46.65,19.6) v1(43.35,19.6)
$2N18900: length 3.9
  Top Layer w0.254: R2.2 44.23,24.53 44.25,24.51 P1.A5
$2N18903: length 3.7
  Top Layer w0.254: R3.2 45.77,21.47 45.75,21.49 P1.B5
$2N18915: length 9.8
  Top Layer w0.254: D1.2 47.51,26.92 v1(46.27,25.67) 46.27,23.85 P1.A9 ; v1(43.48,25.95) 43.75,25.68 P1.A4
  Bottom Layer w0.254: v1(43.48,25.95) 46.02,25.95 46.27,25.7
$2N23008: length 8.1
  Top Layer w0.254: R4.1 12.87,46.91 15.12,44.65 D2.1

## Copper pours and planes (outline as drawn; the poured copper is in the pictures)
GND on Top Layer: 90,45.65 89.96,46.96 89.88,48.27 89.77,49.57 89.62,50.87 89.43,52.17 89.2,53.46 88.93,54.74 88.63,56.01 88.29,57.28 87.92,58.53 87.51,59.77 87.06,61 86.57,62.22 86.06,63.42 85.5,64.61 84.92,65.78 84.29,66.93 83.64,68.06 82.95,69.18 82.23,70.27 81.48,71.34 80.7,72.39 79.89,73.42 79.05,74.42 78.18,75.4 77.28,76.35 76.35,77.28 75.4,78.18 74.42,79.05 73.42,79.89 72.39,80.7 71.34,81.48 70.27,82.23 69.18,82.95 68.06,83.64 66.93,84.29 65.78,84.92 64.61,85.5 63.42,86.06 62.22,86.57 61,87.06 59.77,87.51 58.53,87.92 57.28,88.29 56.01,88.63 54.74,88.93 53.46,89.2 52.17,89.43 50.87,89.62 49.57,89.77 48.27,89.88 46.96,89.96 45.65,90 44.35,90 43.04,89.96 41.73,89.88 40.43,89.77 39.13,89.62 37.83,89.43 36.54,89.2 35.26,88.93 33.99,88.63 32.72,88.29 31.47,87.92 30.23,87.51 29,87.06 27.78,86.57 26.58,86.06 25.39,85.5 24.22,84.92 23.07,84.29 21.94,83.64 20.82,82.95 19.73,82.23 18.66,81.48 17.61,80.7 16.58,79.89 15.58,79.05 14.6,78.18 13.65,77.28 12.72,76.35 11.82,75.4 10.95,74.42 10.11,73.42 9.3,72.39 8.52,71.34 7.77,70.27 7.05,69.18 6.36,68.06 5.71,66.93 5.08,65.78 4.5,64.61 3.94,63.42 3.43,62.22 2.94,61 2.49,59.77 2.08,58.53 1.71,57.28 1.37,56.01 1.07,54.74 0.8,53.46 0.57,52.17 0.38,50.87 0.23,49.57 0.12,48.27 0.04,46.96 0,45.65 0,44.35 0.04,43.04 0.12,41.73 0.23,40.43 0.38,39.13 0.57,37.83 0.8,36.54 1.07,35.26 1.37,33.99 1.71,32.72 2.08,31.47 2.49,30.23 2.94,29 3.43,27.78 3.94,26.58 4.5,25.39 5.08,24.22 5.71,23.07 6.36,21.94 7.05,20.82 7.77,19.73 8.52,18.66 9.3,17.61 10.11,16.58 10.95,15.58 11.82,14.6 12.72,13.65 13.65,12.72 14.6,11.82 15.58,10.95 16.58,10.11 17.61,9.3 18.66,8.52 19.73,7.77 20.82,7.05 21.94,6.36 23.07,5.71 24.22,5.08 25.39,4.5 26.58,3.94 27.78,3.43 29,2.94 30.23,2.49 31.47,2.08 32.72,1.71 33.99,1.37 35.26,1.07 36.54,0.8 37.83,0.57 39.13,0.38 40.43,0.23 41.73,0.12 43.04,0.04 44.35,0 45.65,0 46.96,0.04 48.27,0.12 49.57,0.23 50.87,0.38 52.17,0.57 53.46,0.8 54.74,1.07 56.01,1.37 57.28,1.71 58.53,2.08 59.77,2.49 61,2.94 62.22,3.43 63.42,3.94 64.61,4.5 65.78,5.08 66.93,5.71 68.06,6.36 69.18,7.05 70.27,7.77 71.34,8.52 72.39,9.3 73.42,10.11 74.42,10.95 75.4,11.82 76.35,12.72 77.28,13.65 78.18,14.6 79.05,15.58 79.89,16.58 80.7,17.61 81.48,18.66 82.23,19.73 82.95,20.82 83.64,21.94 84.29,23.07 84.92,24.22 85.5,25.39 86.06,26.58 86.57,27.78 87.06,29 87.51,30.23 87.92,31.47 88.29,32.72 88.63,33.99 88.93,35.26 89.2,36.54 89.43,37.83 89.62,39.13 89.77,40.43 89.88,41.73 89.96,43.04 90,44.35
GND on Bottom Layer: 90,45.65 89.96,46.96 89.88,48.27 89.77,49.57 89.62,50.87 89.43,52.17 89.2,53.46 88.93,54.74 88.63,56.01 88.29,57.28 87.92,58.53 87.51,59.77 87.06,61 86.57,62.22 86.06,63.42 85.5,64.61 84.92,65.78 84.29,66.93 83.64,68.06 82.95,69.18 82.23,70.27 81.48,71.34 80.7,72.39 79.89,73.42 79.05,74.42 78.18,75.4 77.28,76.35 76.35,77.28 75.4,78.18 74.42,79.05 73.42,79.89 72.39,80.7 71.34,81.48 70.27,82.23 69.18,82.95 68.06,83.64 66.93,84.29 65.78,84.92 64.61,85.5 63.42,86.06 62.22,86.57 61,87.06 59.77,87.51 58.53,87.92 57.28,88.29 56.01,88.63 54.74,88.93 53.46,89.2 52.17,89.43 50.87,89.62 49.57,89.77 48.27,89.88 46.96,89.96 45.65,90 44.35,90 43.04,89.96 41.73,89.88 40.43,89.77 39.13,89.62 37.83,89.43 36.54,89.2 35.26,88.93 33.99,88.63 32.72,88.29 31.47,87.92 30.23,87.51 29,87.06 27.78,86.57 26.58,86.06 25.39,85.5 24.22,84.92 23.07,84.29 21.94,83.64 20.82,82.95 19.73,82.23 18.66,81.48 17.61,80.7 16.58,79.89 15.58,79.05 14.6,78.18 13.65,77.28 12.72,76.35 11.82,75.4 10.95,74.42 10.11,73.42 9.3,72.39 8.52,71.34 7.77,70.27 7.05,69.18 6.36,68.06 5.71,66.93 5.08,65.78 4.5,64.61 3.94,63.42 3.43,62.22 2.94,61 2.49,59.77 2.08,58.53 1.71,57.28 1.37,56.01 1.07,54.74 0.8,53.46 0.57,52.17 0.38,50.87 0.23,49.57 0.12,48.27 0.04,46.96 0,45.65 0,44.35 0.04,43.04 0.12,41.73 0.23,40.43 0.38,39.13 0.57,37.83 0.8,36.54 1.07,35.26 1.37,33.99 1.71,32.72 2.08,31.47 2.49,30.23 2.94,29 3.43,27.78 3.94,26.58 4.5,25.39 5.08,24.22 5.71,23.07 6.36,21.94 7.05,20.82 7.77,19.73 8.52,18.66 9.3,17.61 10.11,16.58 10.95,15.58 11.82,14.6 12.72,13.65 13.65,12.72 14.6,11.82 15.58,10.95 16.58,10.11 17.61,9.3 18.66,8.52 19.73,7.77 20.82,7.05 21.94,6.36 23.07,5.71 24.22,5.08 25.39,4.5 26.58,3.94 27.78,3.43 29,2.94 30.23,2.49 31.47,2.08 32.72,1.71 33.99,1.37 35.26,1.07 36.54,0.8 37.83,0.57 39.13,0.38 40.43,0.23 41.73,0.12 43.04,0.04 44.35,0 45.65,0 46.96,0.04 48.27,0.12 49.57,0.23 50.87,0.38 52.17,0.57 53.46,0.8 54.74,1.07 56.01,1.37 57.28,1.71 58.53,2.08 59.77,2.49 61,2.94 62.22,3.43 63.42,3.94 64.61,4.5 65.78,5.08 66.93,5.71 68.06,6.36 69.18,7.05 70.27,7.77 71.34,8.52 72.39,9.3 73.42,10.11 74.42,10.95 75.4,11.82 76.35,12.72 77.28,13.65 78.18,14.6 79.05,15.58 79.89,16.58 80.7,17.61 81.48,18.66 82.23,19.73 82.95,20.82 83.64,21.94 84.29,23.07 84.92,24.22 85.5,25.39 86.06,26.58 86.57,27.78 87.06,29 87.51,30.23 87.92,31.47 88.29,32.72 88.63,33.99 88.93,35.26 89.2,36.54 89.43,37.83 89.62,39.13 89.77,40.43 89.88,41.73 89.96,43.04 90,44.35

## Text on the board
Bottom Silkscreen Layer: Es darf nur ein Anschluss gleichzeitig  verwendet werden (3V3/5V)
Top Silkscreen Layer: 5V GND SCL SDA | Es darf nur ein Anschluss gleichzeitig / verwendet werden! (3V3/5V)
